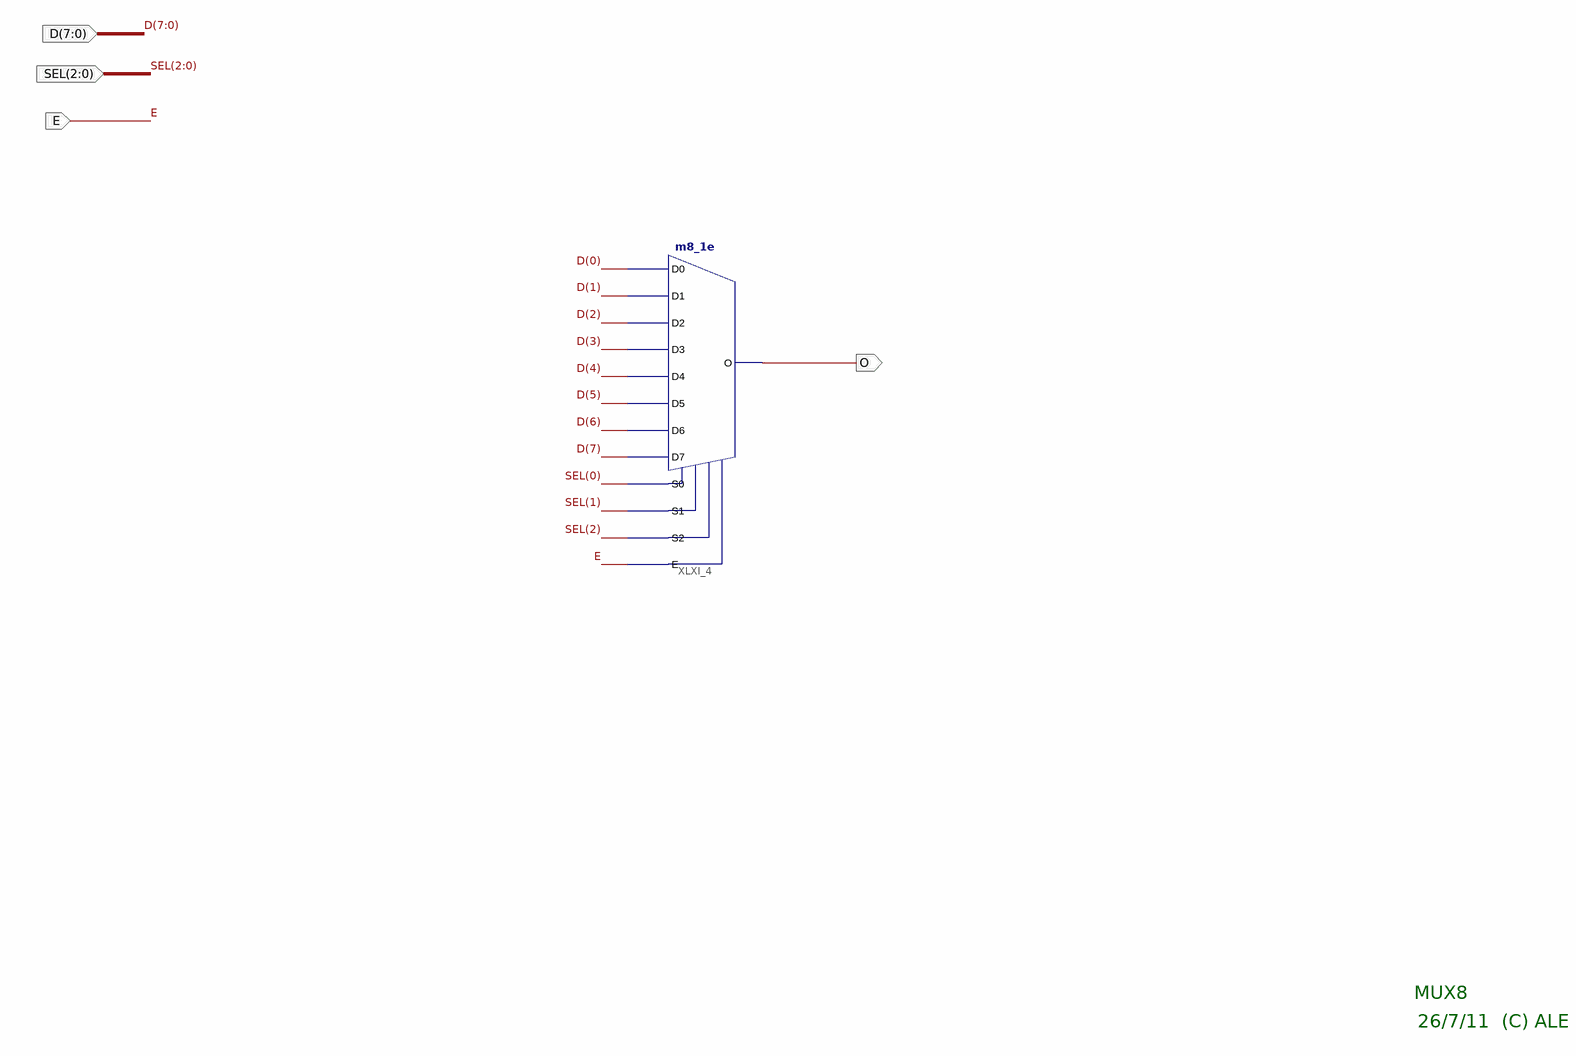
[diagram p0: schematic sheet 1]
// Xilinx ISE schematic Mux8.sch (spartan3e) as structural Verilog: 1 symbols, 4 ports
module Mux8 (
  input  [7:0] D,
  input  [2:0] SEL,
  input  E,
  output O
);

  m8_1e XLXI_4 (
    .D0(D[0]), .D1(D[1]), .D2(D[2]), .D3(D[3]), .D4(D[4]), .D5(D[5]), .D6(D[6]), .D7(D[7]), .E(E),
    .S0(SEL[0]), .S1(SEL[1]), .S2(SEL[2]), .O(O));

  // Notes on the sheet:
  //   MUX8
  //   26/7/11  (C) ALE
endmodule
